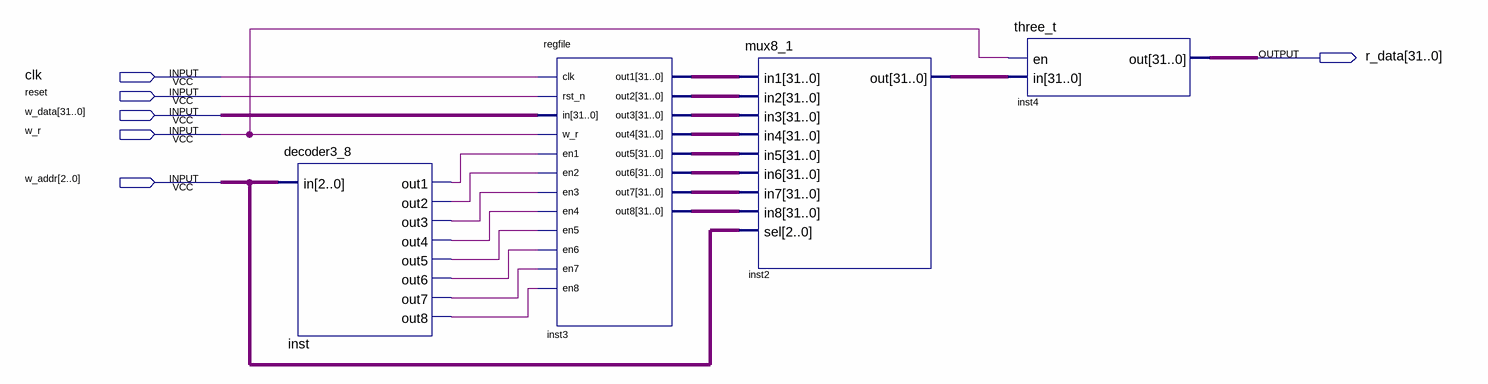
[diagram p0: schematic sheet]
// Quartus schematic reg_8_32.bdf as structural Verilog: 4 symbols, 6 pins
module reg_8_32 (
  input  clk,
  input  reset,
  input  [31:0] w_data,
  input  w_r,
  input  [2:0] w_addr,
  output [31:0] r_data
);

  wire inst_out1, inst_out2, inst_out3, inst_out4, inst_out5, inst_out6, inst_out7, inst_out8;
  wire [31:0] inst2_out, inst3_out1, inst3_out2, inst3_out3, inst3_out4, inst3_out5, inst3_out6, inst3_out7,
       inst3_out8;

  decoder3_8 inst (
    .in(w_addr), .out1(inst_out1), .out2(inst_out2), .out3(inst_out3), .out4(inst_out4), .out5(inst_out5),
    .out6(inst_out6), .out7(inst_out7), .out8(inst_out8));
  regfile inst3 (
    .clk(clk), .rst_n(reset), .in(w_data), .w_r(w_r), .en1(inst_out1), .en2(inst_out2), .en3(inst_out3),
    .en4(inst_out4), .en5(inst_out5), .en6(inst_out6), .en7(inst_out7), .en8(inst_out8), .out1(inst3_out1),
    .out2(inst3_out2), .out3(inst3_out3), .out4(inst3_out4), .out5(inst3_out5), .out6(inst3_out6),
    .out7(inst3_out7), .out8(inst3_out8));
  mux8_1 inst2 (
    .in1(inst3_out1), .in2(inst3_out2), .in3(inst3_out3), .in4(inst3_out4), .in5(inst3_out5),
    .in6(inst3_out6), .in7(inst3_out7), .in8(inst3_out8), .sel(w_addr), .out(inst2_out));
  three_t inst4 (.en(w_r), .in(inst2_out), .out(r_data));
endmodule
